# Altium schematic sheet Controller.SchDoc: Chargeur cellules lithium
size Legal; DocumentNumber: 6; SheetNumber: 6; SheetTotal: 8; Version: Gamma 1.0; Conceptor: Philippe Turgeon
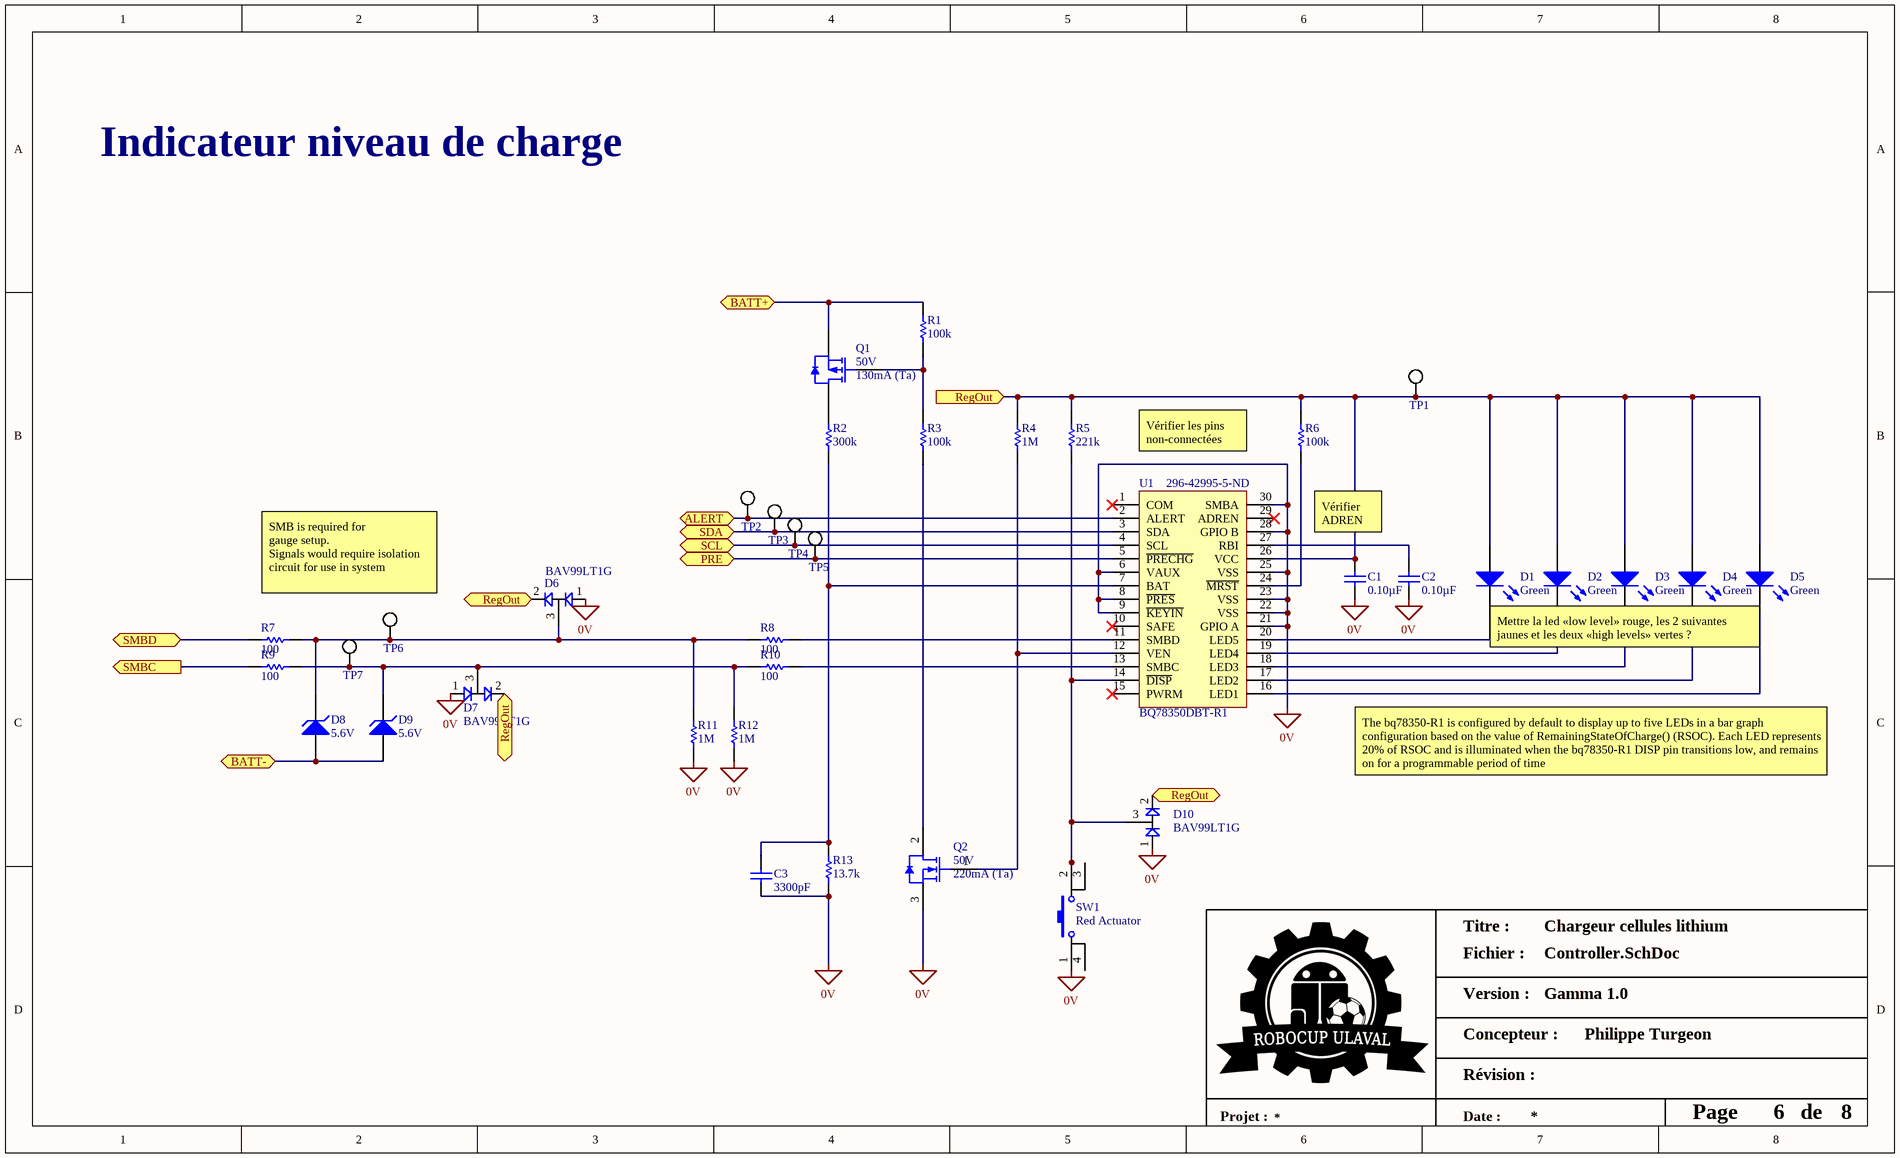
[diagram p0: Controller.SchDoc]

## Parts
C1  Capacitance: 0.10µF  [0603]  (hidden comment: CL10B104KB8SFNC)
C2  Capacitance: 0.10µF  [0603]  (hidden comment: CL10B104KB8SFNC)
C3  Capacitance: 3300pF  [0603]  (hidden comment: CL10B332KB8NNNC)
D1  Color: Green  [0805]  (hidden comment: LG R971-KN-1)
D2  Color: Green  [0805]  (hidden comment: LG R971-KN-1)
D3  Color: Green  [0805]  (hidden comment: LG R971-KN-1)
D4  Color: Green  [0805]  (hidden comment: LG R971-KN-1)
D5  Color: Green  [0805]  (hidden comment: LG R971-KN-1)
D6  BAV99LT1G  [SOT-23-3]
D7  BAV99LT1G  [SOT-23-3]
D8  Voltage - Zener (Nom) (Vz): 5.6V  [SOD-323F]  (hidden comment: MMSZ5232BS-7-F)
D9  Voltage - Zener (Nom) (Vz): 5.6V  [SOD-323F]  (hidden comment: MMSZ5232BS-7-F)
D10  BAV99LT1G  [SOT-23-3]
Q1  Drain to Source Voltage (Vdss): 50V  Current - Continuous Drain (Id) @ 25°C: 130mA (Ta)  [SOT-23-3]  (hidden comment: BSS84-7-F)
Q2  Drain to Source Voltage (Vdss): 50V  Current - Continuous Drain (Id) @ 25°C: 220mA (Ta)  [SOT-23-3]  (hidden comment: BSS138)
R1  Resistance (Ohms): 100k  [0603]  (hidden comment: RC0603JR-07100KL)
R2  Resistance (Ohms): 300k  (hidden comment: RG1608P-304-B-T5)
R3  Resistance (Ohms): 100k  [0603]  (hidden comment: RC0603JR-07100KL)
R4  Resistance (Ohms): 1M  [0603]  (hidden comment: RC0603FR-071ML)
R5  Resistance (Ohms): 221k  [0603]  (hidden comment: RC0603FR-07221KL)
R6  Resistance (Ohms): 100k  [0603]  (hidden comment: RC0603JR-07100KL)
R7  Resistance (Ohms): 100  [0603]  (hidden comment: RC0603FR-07100RL)
R8  Resistance (Ohms): 100  [0603]  (hidden comment: RC0603FR-07100RL)
R9  Resistance (Ohms): 100  [0603]  (hidden comment: RC0603FR-07100RL)
R10  Resistance (Ohms): 100  [0603]  (hidden comment: RC0603FR-07100RL)
R11  Resistance (Ohms): 1M  [0603]  (hidden comment: RC0603FR-071ML)
R12  Resistance (Ohms): 1M  [0603]  (hidden comment: RC0603FR-071ML)
R13  Resistance (Ohms): 13.7k  [0603]  (hidden comment: RC0603FR-0713K7L)
SW1  Features: Red Actuator  [6 mm Tact Switches]  (hidden comment: PTS645SK50SMTR92 LFS)
TP1  testpoint  [0805 testpoint]  (value not drawn)
TP2  testpoint  [0805 testpoint]  (value not drawn)
TP3  testpoint  [0805 testpoint]  (value not drawn)
TP4  testpoint  [0805 testpoint]  (value not drawn)
TP5  testpoint  [0805 testpoint]  (value not drawn)
TP6  testpoint  [0805 testpoint]  (value not drawn)
TP7  testpoint  [0805 testpoint]  (value not drawn)
U1  BQ78350DBT-R1  Supplier Part Number 1: 296-42995-5-ND  [TSSOP-30]

## Ports
ALERT, BATT+, BATT-, PRE, RegOut (in), SCL, SDA, SMBC (out), SMBD (bidir)

## Nets
0V: C1.1 C2.1 C3.1 D6.1(bottom) D7.1(bottom) D10.1(bottom) Q2.3(S) R11.1 R12.1 R13.1 SW1.1 U1.6(VAUX) U1.8(~{PRES}) U1.9(~{KEYIN}) U1.21(GPIO_A) U1.22(VSS) U1.23(VSS) U1.25(VSS) U1.28(GPIO_B) U1.30(SMBA)
ALERT: TP2.1 U1.2(ALERT) ; port ALERT
BATT+: Q1.3(S) R1.2 ; port BATT+
BATT-: D8.1(A) D9.1(A) ; port BATT-
PRE: TP5.1 U1.5(~{PRECHG}) ; port PRE
RegOut: C1.2 D1.1(A) D2.1(A) D3.1(A) D4.1(A) D5.1(A) D6.2(top) D7.2(top) D10.2(top) R4.2 R5.2 R6.2 TP1.1 U1.26(VCC) ; port RegOut
SCL: TP4.1 U1.4(SCL) ; port SCL
SDA: TP3.1 U1.3(SDA) ; port SDA
SMBC: R9.1 ; port SMBC
SMBD: R7.1 ; port SMBD
NetC2_2: C2.2 U1.27(RBI)
NetC3_2: C3.2 R2.1 R13.2 U1.7(BAT)
NetD1_2: D1.2(K) U1.20(LED5)
NetD2_2: D2.2(K) U1.19(LED4)
NetD3_2: D3.2(K) U1.18(LED3)
NetD4_2: D4.2(K) U1.17(LED2)
NetD5_2: D5.2(K) U1.16(LED1)
NetD6_3: D6.3(center) D8.2(K) R7.2 R8.1 R11.2 TP6.1
NetD7_3: D7.3(center) D9.2(K) R9.2 R10.1 R12.2 TP7.1
NetD10_3: D10.3(center) R5.1 SW1.2 U1.14(~{DISP})
NetQ1_1: Q1.1(G) R1.1 R3.2
NetQ1_2: Q1.2(D) R2.2
NetQ2_1: Q2.1(G) R4.1 U1.12(VEN)
NetQ2_2: Q2.2(D) R3.1
NetR6_1: R6.1 U1.24(~{MRST})
NetR8_2: R8.2 U1.11(SMBD)
NetR10_2: R10.2 U1.13(SMBC)

Not connected (* = marked no-connect by the designer): SW1 3 4; U1 1(COM)* 10(SAFE)* 15(PWRM)* 29(ADREN)*

## Notes on the sheet
- Indicateur niveau de charge
- Vérifier les pins non-connectées
- Vérifier ADREN
- SMB is required for
  gauge setup.
  Signals would require isolation
  circuit for use in system
- Mettre la led «low level» rouge, les 2 suivantes jaunes et les deux «high levels» vertes ?
- The bq78350-R1 is configured by default to display up to five LEDs in a bar graph configuration based on the value of RemainingStateOfCharge() (RSOC). Each LED represents 20% of RSOC and is illuminated when the bq78350-R1 DISP pin transitions low, and remains on for a programmable period of time
- Titre :
- Fichier :
- Version :
- Concepteur :
- Révision :
- Projet :
- Date :
- Page
- de

## Library data of the parts
C1 C2 = CL10B104KB8SFNC: CAP CER 0.1UF 50V X7R 0603; Manufacturer: Samsung Electro-Mechanics America, Inc.; Tolerance: ±10%; Supplier 1: Digi-Key; Manufacturer Part Number: CL10B104KB8SFNC; RoHS: RoHS Compliant; Category: Capacitors; Stock 1: 2612665; Pricing 1: 1=0.14, 10=0.028, 25=0.0204, 50=0.0156, 100=0.0127, 250=0.01064, 500=0.00908, 1000=0.00712 (CAD); Packaging: Cut Tape (CT); Voltage - Rated: 50V; Temperature Coefficient: X7R; Mounting Type: Surface Mount, MLCC; Operating Temperature: -55°C ~ 125°C; Applications: Boardflex Sensitive; Ratings: -; Package / Case: 0603 (1608 Metric); Size / Dimension: 0.063" L x 0.031" W (1.60mm x 0.80mm); Height - Seated (Max): -; Thickness (Max): 0.035" (0.90mm); Lead Spacing: -; Features: Soft Termination; Lead Style: -; ComponentLink1URL: http://www.samsungsem.com/kr/support/product-search/mlcc/CL10B104KB8SFNC.jsp; ComponentLink1Description: http://www.samsungsem.com/kr/support/product-search/mlcc/CL10B104KB8SFNC.jsp; Supplier Part Number 1: 1276-1936-1-ND
C3 = CL10B332KB8NNNC: CAP CER 3300PF 50V X7R 0603; Manufacturer: Samsung Electro-Mechanics America, Inc.; Tolerance: ±10%; Supplier 1: Digi-Key; Manufacturer Part Number: CL10B332KB8NNNC; RoHS: RoHS Compliant; Category: Capacitors; Stock 1: 38969; Pricing 1: 1=0.14, 10=0.043, 25=0.0296, 50=0.0228, 100=0.0192, 500=0.01348, 1000=0.01049 (CAD); Packaging: Cut Tape (CT); Voltage - Rated: 50V; Temperature Coefficient: X7R; Mounting Type: Surface Mount, MLCC; Operating Temperature: -55°C ~ 125°C; Applications: General Purpose; Ratings: -; Package / Case: 0603 (1608 Metric); Size / Dimension: 0.063" L x 0.031" W (1.60mm x 0.80mm); Height - Seated (Max): -; Thickness (Max): 0.035" (0.90mm); Lead Spacing: -; Features: -; Lead Style: -; ComponentLink1URL: http://www.samsungsem.com/kr/support/product-search/mlcc/CL10B332KB8NNNC.jsp; ComponentLink1Description: http://www.samsungsem.com/kr/support/product-search/mlcc/CL10B332KB8NNNC.jsp; Supplier Part Number 1: 1276-1758-1-ND
D1-D5 = LG R971-KN-1: LED GREEN DIFFUSED 0805 SMD; Manufacturer: OSRAM Opto Semiconductors Inc.; Lens Color: White; Millicandela Rating: 26.05mcd; Lens Style/Size: Rectangle with Flat Top, 1.30mm x 1.25mm; Voltage - Forward (Vf) (Typ): 2.2V; Current - Test: 20mA; Viewing Angle: 160°; Wavelength - Dominant: 570nm; Wavelength - Peak: 572nm; Supplier 1: Digi-Key; Supplier Part Number 1: 475-1410-1-ND; Manufacturer Part Number: LG R971-KN-1; RoHS: RoHS Compliant; Category: Optoelectronics; Stock 1: 315869; Pricing 1: 1=0.37, 10=0.267, 25=0.1972, 100=0.141, 250=0.09588, 500=0.0846, 1000=0.06626 (CAD); Packaging: Cut Tape (CT); Lens Transparency: Diffused; Mounting Type: Surface Mount; Features: -; Package / Case: 0805 (2012 Metric); Supplier Device Package: *; Size / Dimension: 2.00mm L x 1.25mm W; Height (Max): 0.90mm; ComponentLink1URL: http://www.osram-os.com/Graphics/XPic9/00078860_0.pdf; ComponentLink1Description: http://www.osram-os.com/Graphics/XPic9/00078860_0.pdf
D6 D7 D10 = BAV99LT1G: DIODE ARRAY GP 70V 215MA SOT23-3; Manufacturer: ON Semiconductor; Diode Configuration: 1 Pair Series Connection; Diode Type: Standard; Current - Average Rectified (Io) (per Diode): 215mA (DC); Voltage - Forward (Vf) (Max) @ If: 1.25V @ 150mA; Speed: Fast Recovery =< 500ns, > 200mA (Io); Reverse Recovery Time (trr): 6ns; Current - Reverse Leakage @ Vr: 2.5µA @ 70V; Supplier 1: Digi-Key; Supplier Part Number 1: BAV99LT1GOSCT-ND; Manufacturer Part Number: BAV99LT1G; RoHS: RoHS Compliant; Category: Discrete Semiconductor Products; Stock 1: 204227; Pricing 1: 1=0.17, 10=0.158, 100=0.0859, 500=0.0528, 1000=0.03603 (CAD); Packaging: Cut Tape (CT); Voltage - DC Reverse (Vr) (Max): 70V; Mounting Type: Surface Mount; Package / Case: TO-236-3, SC-59, SOT-23-3; Supplier Device Package: SOT-23-3 (TO-236); ComponentLink1URL: http://www.onsemi.com/pub_link/Collateral/BAV99LT1-D.PDF; ComponentLink1Description: http://www.onsemi.com/pub_link/Collateral/BAV99LT1-D.PDF
D8 D9 = MMSZ5232BS-7-F: DIODE ZENER 5.6V 200MW SOD323; Manufacturer: Diodes Incorporated; Tolerance: ±5%; Impedance (Max) (Zzt): 11 Ohm; Current - Reverse Leakage @ Vr: 5µA @ 3V; Voltage - Forward (Vf) (Max) @ If: 900mV @ 10mA; Supplier 1: Digi-Key; Supplier Part Number 1: MMSZ5232BS-FDICT-ND; Manufacturer Part Number: MMSZ5232BS-7-F; RoHS: RoHS Compliant; Category: Discrete Semiconductor Products; Stock 1: 18561; Pricing 1: 1=0.47, 10=0.351, 100=0.1988, 500=0.1318, 1000=0.10109 (CAD); Packaging: Cut Tape (CT); Power - Max: 200mW; Operating Temperature: -65°C ~ 150°C; Mounting Type: Surface Mount; Package / Case: SC-76, SOD-323; Supplier Device Package: SOD-323; ComponentLink1URL: http://www.diodes.com/_files/datasheets/ds31038.pdf; ComponentLink1Description: http://www.diodes.com/_files/datasheets/ds31038.pdf
Q1 = BSS84-7-F: MOSFET P-CH 50V 130MA SOT23-3; Manufacturer: Diodes Incorporated; FET Type: MOSFET P-Channel, Metal Oxide; FET Feature: Standard; Rds On (Max) @ Id, Vgs: 10 Ohm @ 100mA, 5V; Vgs(th) (Max) @ Id: 2V @ 1mA; Input Capacitance (Ciss) @ Vds: 45pF @ 25V; Power - Max: 300mW; Supplier 1: Digi-Key; Supplier Part Number 1: BSS84-FDICT-ND; Manufacturer Part Number: BSS84-7-F; RoHS: RoHS Compliant; Category: Discrete Semiconductor Products; Stock 1: 64867; Pricing 1: 1=0.34, 10=0.276, 100=0.146, 500=0.09606, 1000=0.06545 (CAD); Packaging: Cut Tape (CT); Gate Charge (Qg) @ Vgs: -; Operating Temperature: -55°C ~ 150°C (TJ); Mounting Type: Surface Mount; Package / Case: TO-236-3, SC-59, SOT-23-3; Supplier Device Package: SOT-23-3; ComponentLink1URL: http://www.diodes.com/_files/datasheets/ds30149.pdf; ComponentLink1Description: http://www.diodes.com/_files/datasheets/ds30149.pdf
Q2 = BSS138: MOSFET N-CH 50V 220MA SOT-23; Manufacturer: Fairchild Semiconductor; FET Type: MOSFET N-Channel, Metal Oxide; FET Feature: Logic Level Gate; Rds On (Max) @ Id, Vgs: 3.5 Ohm @ 220mA, 10V; Vgs(th) (Max) @ Id: 1.5V @ 1mA; Gate Charge (Qg) @ Vgs: 2.4nC @ 10V; Input Capacitance (Ciss) @ Vds: 27pF @ 25V; Power - Max: 360mW; Supplier 1: Digi-Key; Supplier Part Number 1: BSS138CT-ND; Manufacturer Part Number: BSS138; RoHS: RoHS Compliant; Category: Discrete Semiconductor Products; Stock 1: 202195; Pricing 1: 1=0.31, 10=0.253, 100=0.1344, 500=0.08836, 1000=0.0602 (CAD); Packaging: Cut Tape (CT); Operating Temperature: -55°C ~ 150°C (TJ); Mounting Type: Surface Mount; Package / Case: TO-236-3, SC-59, SOT-23-3; Supplier Device Package: SOT-23-3; ComponentLink1URL: http://www.fairchildsemi.com/datasheets/BS/BSS138.pdf; ComponentLink1Description: http://www.fairchildsemi.com/datasheets/BS/BSS138.pdf
R1 R3 R6 = RC0603JR-07100KL: RES SMD 100K OHM 5% 1/10W 0603; Manufacturer: Yageo; Power (Watts): 0.1W, 1/10W; Temperature Coefficient: ±100ppm/°C; Supplier 1: Digi-Key; Manufacturer Part Number: RC0603JR-07100KL; RoHS: RoHS Compliant; Category: Resistors; Stock 1: 2803334; Pricing 1: 1=0.15, 10=0.017, 25=0.012, 100=0.0067, 250=0.00508, 500=0.00408, 1000=0.003, 2500=0.0026 (CAD); Packaging: Cut Tape (CT); Tolerance: ±5%; Composition: Thick Film; Features: Moisture Resistant; Operating Temperature: -55°C ~ 155°C; Package / Case: 0603 (1608 Metric); Supplier Device Package: 0603; Size / Dimension: 0.063" L x 0.031" W (1.60mm x 0.80mm); Height: 0.022" (0.55mm); Number of Terminations: 2; ComponentLink1URL: http://www.yageo.com/documents/recent/PYu-RC_Group_51_RoHS_L_04.pdf; ComponentLink1Description: http://www.yageo.com/documents/recent/PYu-RC_Group_51_RoHS_L_04.pdf; Supplier Part Number 1: 311-100KGRCT-ND
R2 = RG1608P-304-B-T5: RES SMD 300K OHM 0.1% 1/10W 0603; Manufacturer: Susumu; Power (Watts): 0.1W, 1/10W; Temperature Coefficient: ±25ppm/°C; Supplier 1: Digi-Key; Manufacturer Part Number: RG1608P-304-B-T5; RoHS: RoHS Compliant; Category: Resistors; Stock 1: 2495; Pricing 1: 1=0.61, 10=0.459, 25=0.3488, 50=0.2592, 100=0.1927, 250=0.1628, 500=0.13954, 1000=0.10632 (CAD); Packaging: Cut Tape (CT); Tolerance: ±0.1%; Composition: Thin Film; Features: Automotive AEC-Q200; Operating Temperature: -55°C ~ 155°C; Package / Case: 0603 (1608 Metric); Supplier Device Package: 0603; Size / Dimension: 0.063" L x 0.031" W (1.60mm x 0.80mm); Height: 0.020" (0.50mm); Number of Terminations: 2; ComponentLink1URL: http://www.susumu-usa.com/pdf/RG_RM_RGH_DATASHEET.pdf; ComponentLink1Description: http://www.susumu-usa.com/pdf/RG_RM_RGH_DATASHEET.pdf; Supplier Part Number 1: RG16P300KBCT-ND
R4 R11 R12 = RC0603FR-071ML: RES SMD 1M OHM 1% 1/10W 0603; Manufacturer: Yageo; Power (Watts): 0.1W, 1/10W; Temperature Coefficient: ±100ppm/°C; Supplier 1: Digi-Key; Manufacturer Part Number: RC0603FR-071ML; RoHS: RoHS Compliant; Category: Resistors; Stock 1: 1571699; Pricing 1: 1=0.15, 10=0.021, 25=0.0152, 100=0.0086, 250=0.0066, 500=0.00526, 1000=0.00389, 2500=0.00337 (CAD); Packaging: Cut Tape (CT); Tolerance: ±1%; Composition: Thick Film; Features: Moisture Resistant; Operating Temperature: -55°C ~ 155°C; Package / Case: 0603 (1608 Metric); Supplier Device Package: 0603; Size / Dimension: 0.063" L x 0.031" W (1.60mm x 0.80mm); Height: 0.022" (0.55mm); Number of Terminations: 2; ComponentLink1URL: http://www.yageo.com/documents/recent/PYu-RC_Group_51_RoHS_L_04.pdf; ComponentLink1Description: http://www.yageo.com/documents/recent/PYu-RC_Group_51_RoHS_L_04.pdf; Supplier Part Number 1: 311-1.00MHRCT-ND
R5 = RC0603FR-07221KL: RES SMD 221K OHM 1% 1/10W 0603; Manufacturer: Yageo; Power (Watts): 0.1W, 1/10W; Temperature Coefficient: ±100ppm/°C; Supplier 1: Digi-Key; Manufacturer Part Number: RC0603FR-07221KL; RoHS: RoHS Compliant; Category: Resistors; Stock 1: 288409; Pricing 1: 1=0.15, 10=0.021, 25=0.0152, 100=0.0086, 250=0.0066, 500=0.00526, 1000=0.00389, 2500=0.00337 (CAD); Packaging: Cut Tape (CT); Tolerance: ±1%; Composition: Thick Film; Features: Moisture Resistant; Operating Temperature: -55°C ~ 155°C; Package / Case: 0603 (1608 Metric); Supplier Device Package: 0603; Size / Dimension: 0.063" L x 0.031" W (1.60mm x 0.80mm); Height: 0.022" (0.55mm); Number of Terminations: 2; ComponentLink1URL: http://www.yageo.com/documents/recent/PYu-RC_Group_51_RoHS_L_04.pdf; ComponentLink1Description: http://www.yageo.com/documents/recent/PYu-RC_Group_51_RoHS_L_04.pdf; Supplier Part Number 1: 311-221KHRCT-ND
R7-R10 = RC0603FR-07100RL: RES SMD 100 OHM 1% 1/10W 0603; Manufacturer: Yageo; Power (Watts): 0.1W, 1/10W; Temperature Coefficient: ±100ppm/°C; Supplier 1: Digi-Key; Manufacturer Part Number: RC0603FR-07100RL; RoHS: RoHS Compliant; Category: Resistors; Stock 1: 2558990; Pricing 1: 1=0.15, 10=0.021, 25=0.0152, 100=0.0086, 250=0.0066, 500=0.00526, 1000=0.00389, 2500=0.00337 (CAD); Packaging: Cut Tape (CT); Tolerance: ±1%; Composition: Thick Film; Features: Moisture Resistant; Operating Temperature: -55°C ~ 155°C; Package / Case: 0603 (1608 Metric); Supplier Device Package: 0603; Size / Dimension: 0.063" L x 0.031" W (1.60mm x 0.80mm); Height: 0.022" (0.55mm); Number of Terminations: 2; ComponentLink1URL: http://www.yageo.com/documents/recent/PYu-RC_Group_51_RoHS_L_04.pdf; ComponentLink1Description: http://www.yageo.com/documents/recent/PYu-RC_Group_51_RoHS_L_04.pdf; Supplier Part Number 1: 311-100HRCT-ND
R13 = RC0603FR-0713K7L: RES SMD 13.7K OHM 1% 1/10W 0603; Manufacturer: Yageo; Power (Watts): 0.1W, 1/10W; Temperature Coefficient: ±100ppm/°C; Supplier 1: Digi-Key; Manufacturer Part Number: RC0603FR-0713K7L; RoHS: RoHS Compliant; Category: Resistors; Stock 1: 164857; Pricing 1: 1=0.15, 10=0.021, 25=0.0152, 100=0.0086, 250=0.0066, 500=0.00526, 1000=0.00389, 2500=0.00337 (CAD); Packaging: Cut Tape (CT); Tolerance: ±1%; Composition: Thick Film; Features: Moisture Resistant; Operating Temperature: -55°C ~ 155°C; Package / Case: 0603 (1608 Metric); Supplier Device Package: 0603; Size / Dimension: 0.063" L x 0.031" W (1.60mm x 0.80mm); Height: 0.022" (0.55mm); Number of Terminations: 2; ComponentLink1URL: http://www.yageo.com/documents/recent/PYu-RC_Group_51_RoHS_L_04.pdf; ComponentLink1Description: http://www.yageo.com/documents/recent/PYu-RC_Group_51_RoHS_L_04.pdf; Supplier Part Number 1: 311-13.7KHRCT-ND
SW1 = PTS645SK50SMTR92 LFS: SWITCH TACTILE SPST-NO 0.05A 12V; Manufacturer: C&K Components; Switch Function: Off-Mom; Contact Rating @ Voltage: 0.05A @ 12VDC; Actuator Type: Standard; Actuator Height off PCB, from Pins: 5.00mm; Actuator Orientation: Top Actuated; Outline: 6.00mm x 6.00mm; Illumination: Non-Illuminated; Operating Force: 260gf; Actuator Material: Polyamide (PA66), Nylon 6/6; Mechanical Life: 100,000 Cycles; Supplier 1: Digi-Key; Supplier Part Number 1: CKN9087CT-ND; Manufacturer Part Number: PTS645SK50SMTR92 LFS; RoHS: RoHS Compliant; Category: Switches; Stock 1: 73782; Pricing 1: 1=0.38, 10=0.362, 25=0.35, 50=0.3374, 100=0.3186, 250=0.29976, 500=0.2873 (CAD); Packaging: Cut Tape (CT); Circuit: SPST-NO; Mounting Type: Surface Mount; Termination Style: Gull Wing; Illumination Voltage (Nominal): -; Illumination Type, Color: -; Ingress Protection: -; Switch Travel: -; Operating Temperature: -20°C ~ 60°C; ComponentLink1URL: http://media.digikey.com/pdf/Data%20Sheets/C&K/PTS645_Series.pdf; ComponentLink1Description: http://media.digikey.com/pdf/Data%20Sheets/C&K/PTS645_Series.pdf
U1 = BQ78350DBT-R1: IC BATTERY MGMT CTRLR 30TSSOP; Manufacturer: Texas Instruments; Function: Battery Monitor; Battery Chemistry: Multi-Chemistry; Number of Cells: 1 ~ 10; Fault Protection: Over Current, Over Temperature, Over/Under Voltage; Interface: SMBus; Drawing Number: 296; 4073252-5; DBT; 30; Supplier 1: Digi-Key; Manufacturer Part Number: BQ78350DBT-R1; RoHS: RoHS Compliant; Category: Integrated Circuits (ICs); Stock 1: 0; Pricing 1: 1=8.18, 10=7.346, 100=6.0192, 500=5.12396, 1000=3.85841 (CAD); Packaging: Tube; Operating Temperature: -40°C ~ 85°C (TA); Package / Case: 30-TFSOP (0.173", 4.40mm Width); Supplier Device Package: 30-TSSOP; ComponentLink1URL: http://www.ti.com/lit/ds/symlink/bq78350-r1.pdf; ComponentLink1Description: http://www.ti.com/lit/ds/symlink/bq78350-r1.pdf